# EAGLE design ad9200_breakout (EAGLE 8.5.2)
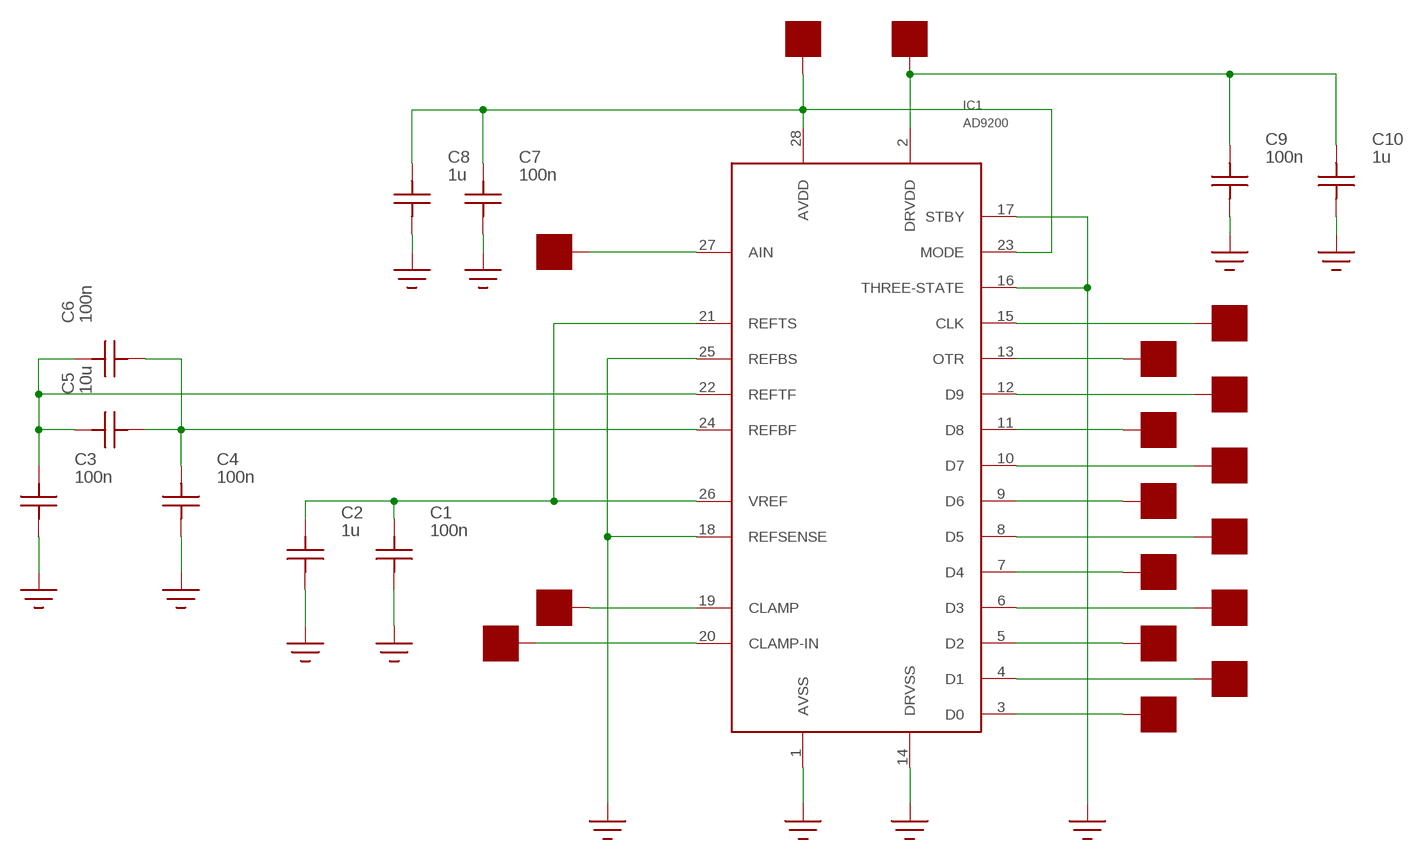
[diagram p0: schematic, sheet 1]

## Parts
C1  100n  C0603  [C0603]
C2  1u  C0603  [C0603]
C3  100n  C0603  [C0603]
C4  100n  C0603  [C0603]
C5  10u  C0603  [C0603]
C6  100n  C0603  [C0603]
C7  100n  C0603  [C0603]
C8  1u  C0603  [C0603]
C9  100n  C0603  [C0603]
C10  1u  C0603  [C0603]
IC1  AD9200  [SSOP-28]
U$5  PAD50MIL  [PAD_50MIL]
U$6  PAD50MIL  [PAD_50MIL]
U$7  PAD50MIL  [PAD_50MIL]
U$8  PAD50MIL  [PAD_50MIL]
U$9  PAD50MIL  [PAD_50MIL]
U$10  PAD50MIL  [PAD_50MIL]
U$11  PAD50MIL  [PAD_50MIL]
U$12  PAD50MIL  [PAD_50MIL]
U$13  PAD50MIL  [PAD_50MIL]
U$14  PAD50MIL  [PAD_50MIL]
U$15  PAD50MIL  [PAD_50MIL]
U$16  PAD50MIL  [PAD_50MIL]
U$17  PAD50MIL  [PAD_50MIL]
U$18  PAD50MIL  [PAD_50MIL]
U$19  PAD50MIL  [PAD_50MIL]
U$20  PAD50MIL  [PAD_50MIL]
U$21  PAD50MIL  [PAD_50MIL]

## Nets
GND: C1.P$1 C2.P$1 C3.P$1 C4.P$1 C7.P$1 C8.P$1 C9.P$1 C10.P$1 IC1.1(AVSS) IC1.14(DRVSS) IC1.16(THREE-STATE) IC1.17(STBY) IC1.18(REFSENSE) IC1.25(REFBS)
N$1: C4.P$2 C5.P$1 C6.P$1 IC1.24(REFBF)
N$2: C1.P$2 C2.P$2 IC1.21(REFTS) IC1.26(VREF)
N$3: C3.P$2 C5.P$2 C6.P$2 IC1.22(REFTF)
N$4: C7.P$2 C8.P$2 IC1.23(MODE) IC1.28(AVDD) U$18.P$1
N$5: IC1.3(D0) U$5.P$1
N$6: IC1.4(D1) U$6.P$1
N$7: IC1.5(D2) U$7.P$1
N$8: IC1.6(D3) U$8.P$1
N$9: IC1.7(D4) U$9.P$1
N$10: IC1.8(D5) U$10.P$1
N$11: IC1.9(D6) U$11.P$1
N$12: IC1.10(D7) U$12.P$1
N$13: IC1.11(D8) U$13.P$1
N$14: IC1.12(D9) U$14.P$1
N$15: IC1.13(OTR) U$15.P$1
N$16: IC1.15(CLK) U$16.P$1
N$17: IC1.27(AIN) U$17.P$1
N$19: C9.P$2 C10.P$2 IC1.2(DRVDD) U$19.P$1
N$20: IC1.19(CLAMP) U$20.P$1
N$21: IC1.20(CLAMP-IN) U$21.P$1

## Library data of the parts
C1-C10 = led_oscilloscope:C
IC1 = led_oscilloscope:AD9200
U$5-U$21 = led_oscilloscope:PAD

## Board
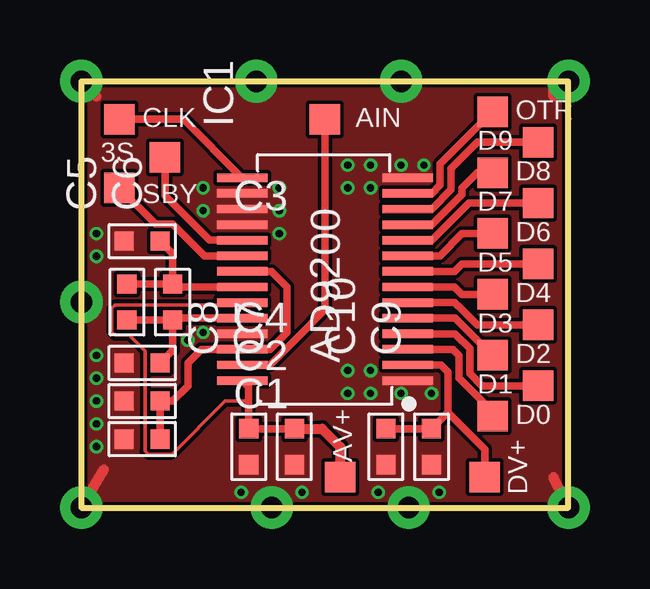
[diagram p1: board, top side]
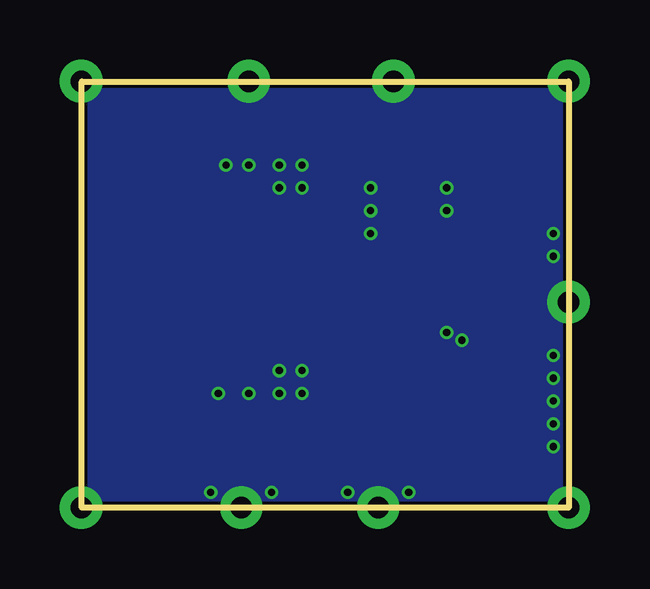
[diagram p2: board, bottom side, seen from below]

Size 20.3 x 17.77 mm. Coordinates in mm from the lower left corner, seen from the top.
Outline: 0,0 20.3,0 20.3,17.77 0,17.77 0,0
Copper layers (1*16): Top 0.035559375mm / dielectric 1.6mm / Bottom 0.035559375mm
Design rules "oshpark-2layer *": minimum track width 6mil, minimum drill 10mil, track to track 6mil, track to pad 6mil, pad to pad 6mil, via to via 6mil, smd to smd 6mil, copper to edge 5mil, drill to drill 6mil, minimum pad ring 5mil, minimum via ring 5mil, stop-mask expansion 2.5mil, vias tented up to drill 0mil, thermal gap 10mil

### Footprints (pad centres in the part's own frame; a part is rotated, then mirrored left to right if it is on the bottom)
C0603 = smd 0.8 x 0.8: P$1 -0.75,0; P$2 0.75,0
SSOP-28 = smd 0.35 x 2.1: 1 -4.225,-3.45; 2 -3.575,-3.45; 3 -2.925,-3.45; 4 -2.275,-3.45; 5 -1.625,-3.45; 6 -0.975,-3.45; 7 -0.325,-3.45; 8 0.325,-3.45; 9 0.975,-3.45; 10 1.625,-3.45; 11 2.275,-3.45; 12 2.925,-3.45; 13 3.575,-3.45; 14 4.225,-3.45; 15 4.225,3.45; 16 3.575,3.45; 17 2.925,3.45; 18 2.275,3.45; 19 1.625,3.45; 20 0.975,3.45; 21 0.325,3.45; 22 -0.325,3.45; 23 -0.975,3.45; 24 -1.625,3.45; 25 -2.275,3.45; 26 -2.925,3.45; 27 -3.575,3.45; 28 -4.225,3.45
PAD_50MIL = smd 1.27 x 1.27: P$1 0,0

### Placement (x,y rotation side)
C1  2.54,2.86 0 top
C2  2.54,4.45 0 top
C3  2.54,11.11 0 top
C4  2.54,6.03 0 top
C5  1.91,8.57 90 top
C6  3.81,8.57 90 top
C7  8.89,2.54 90 top
C8  6.99,2.54 90 top
C9  14.61,2.54 90 top
C10  12.7,2.54 90 top
IC1  10.16,9.53 90 top
U$5  17.14,3.81 0 top
U$6  19.05,5.08 0 top
U$7  17.14,6.35 0 top
U$8  19.05,7.62 0 top
U$9  17.14,8.89 0 top
U$10  19.05,10.16 0 top
U$11  17.14,11.43 0 top
U$12  19.05,12.7 0 top
U$13  17.14,13.97 0 top
U$14  19.05,15.24 0 top
U$15  17.14,16.51 0 top
U$16  1.59,16.19 0 top
U$17  10.16,16.19 0 top
U$18  10.79,1.27 0 top
U$19  16.83,1.27 0 top
U$20  3.49,14.61 0 top
U$21  1.59,13.34 0 top

### Tracks (layer width: path | path; a pad name or v marks a point on that pad's centre or on a via)
GND  (via drill 0.3, 0.9 pad 1.78)
  Top 0.406: v0,17.78 0.64,17.14 | v20.32,17.78 19.68,17.14 19.68,17.46 | v20.32,0 19.68,1.27 | v0,0 0.95,1.59
  other vias: 4.45,6.99 12.06,13.34 11.11,13.34 11.11,14.29 12.06,14.29 12.06,4.76 11.11,4.76 11.11,5.71 12.06,5.71 13.34,14.29 14.29,14.29 14.61,4.76 13.34,4.76 8.26,13.34 8.26,12.38 8.26,11.43 0.64,6.35 0.64,4.45 0.64,2.54 0.64,11.43 9.21,0.64 0.64,10.48 0.64,5.4 0.64,3.49 5.08,13.34 5.08,12.38 6.67,0.64 12.38,0.64 14.92,0.64 0,8.57 7.94,0 13.65,0 7.3,17.78 5.08,7.3 13.34,17.78
  pour Bottom (no thermals): 0,0 20.32,0 20.32,17.78 0,17.78
  pour Top (no thermals): 0,0 20.32,0 20.32,17.78 0,17.78
N$1
  Top 0.305: C5.P$1 C6.P$1 | IC1.24 3.89,7.9 C6.P$1 | C6.P$1 3.81,6.55 C4.P$2
N$2
  Top 0.305: C1.P$2 C2.P$2 3.81,4.45 4.45,5.08 4.45,6.03 5.01,6.6 IC1.26 7.87,6.6 8.57,7.3 8.57,9.21 7.93,9.85 IC1.21
N$3
  Top 0.305: C6.P$2 C5.P$2 | IC1.22 3.93,9.2 C6.P$2 | C6.P$2 3.81,10.59 C3.P$2
N$4
  Top 0.152: IC1.23 6.61,8.45 1.41,8.45 1.28,8.32 1.28,7.33 1.41,7.19 2,7.19 2.66,6.53 2.66,2.36 2.79,2.23 3.79,2.23 6,4.45 6.99,4.45
  Top 0.305: C7.P$2 C8.P$2 6.99,4.45 6.99,5.03 IC1.28
  Top 0.406: C7.P$2 10.04,3.29 10.79,2.54 U$18.P$1
N$5
  Top 0.305: IC1.3 15.5,6.6 15.75,6.35 15.75,5.4 17.14,4 U$5.P$1
N$6
  Top 0.305: IC1.4 15.59,7.25 16.2,6.63 16.2,5.59 16.71,5.08 U$6.P$1
N$7
  Top 0.305: IC1.5 15.58,7.9 16.32,7.16 16.33,7.16 U$7.P$1
N$8
  Top 0.305: IC1.6 15.57,8.55 15.69,8.43 15.7,8.43 16.51,7.62 U$8.P$1
N$9
  Top 0.305: IC1.7 15.56,9.2 15.88,8.89 U$9.P$1
N$10
  Top 0.305: IC1.8 15.56,9.85 15.88,10.16 U$10.P$1
N$11
  Top 0.305: IC1.9 14.95,10.5 15.88,11.43 U$11.P$1
N$12
  Top 0.305: IC1.10 14.62,11.15 14.96,11.5 16.16,12.7 U$12.P$1
N$13
  Top 0.305: IC1.11 14.62,11.8 15.88,13.06 15.88,13.34 16.51,13.97 U$13.P$1
N$14
  Top 0.305: IC1.12 14.62,12.45 15.42,13.26 15.42,14.14 16.52,15.24 U$14.P$1
N$15
  Top 0.305: IC1.13 14.62,13.1 14.96,13.45 14.96,14.33 U$15.P$1
N$16
  Top 0.305: IC1.15 4.27,16.19 U$16.P$1
N$17
  Top 0.305: IC1.27 7.87,5.95 9.03,7.11 9.03,7.12 10.16,8.26 U$17.P$1
N$19
  Top 0.305: IC1.2 15.01,5.95 15.29,5.66 15.29,3.98 | 15.29,3.98 15.29,3.96 16.83,2.43 U$19.P$1 | C10.P$2 C9.P$2 15.29,3.98
N$20
  Top 0.305: IC1.19 5.36,11.15 3.49,13.02 U$20.P$1
N$21
  Top 0.305: U$21.P$1 3.1,11.82 3.82,11.82 5.13,10.5 IC1.20

### Text on the board
tPlace: CLK | AIN | OTR | 3S | D9 | D8 | SBY | D7 | D6 | D5 | D4 | D3 | AD9200 | D2 | D1 | AV+ | DV+ | D0